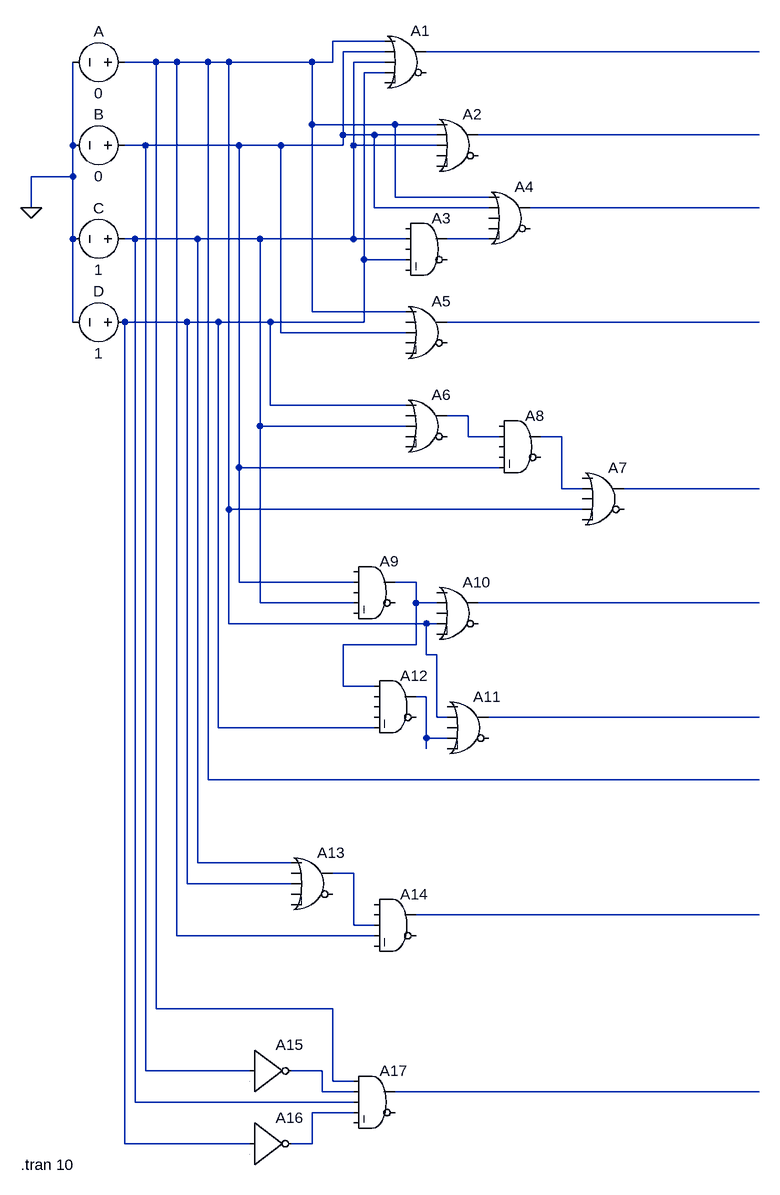
[diagram p0: schematic EqualANDGreater.asc]
EqualANDGreater.asc, the LTspice schematic file:
Version 4.1
SHEET 1 1012 1568
WIRE 432 -176 352 -176
WIRE 432 -160 368 -160
WIRE 1008 -160 496 -160
WIRE 80 -144 32 -144
WIRE 112 -144 80 -144
WIRE 160 -144 112 -144
WIRE 192 -144 160 -144
WIRE 320 -144 192 -144
WIRE 352 -144 352 -176
WIRE 352 -144 320 -144
WIRE 432 -144 384 -144
WIRE 432 -128 400 -128
WIRE 320 -48 320 -144
WIRE 448 -48 320 -48
WIRE 512 -48 448 -48
WIRE 368 -32 368 -160
WIRE 416 -32 368 -32
WIRE 512 -32 416 -32
WIRE 1008 -32 576 -32
WIRE -48 -16 -48 -144
WIRE 64 -16 32 -16
WIRE 208 -16 64 -16
WIRE 272 -16 208 -16
WIRE 368 -16 368 -32
WIRE 368 -16 272 -16
WIRE 384 -16 384 -144
WIRE 512 -16 384 -16
WIRE -48 32 -48 -16
WIRE -48 32 -112 32
WIRE 448 64 448 -48
WIRE 592 64 448 64
WIRE -112 80 -112 32
WIRE 416 80 416 -32
WIRE 592 80 416 80
WIRE 1008 80 656 80
WIRE -48 128 -48 32
WIRE 48 128 32 128
WIRE 144 128 48 128
WIRE 240 128 144 128
WIRE 384 128 384 -16
WIRE 384 128 240 128
WIRE 464 128 384 128
WIRE 592 128 528 128
WIRE 400 160 400 -128
WIRE 464 160 400 160
WIRE 320 240 320 -48
WIRE 464 240 320 240
WIRE -48 256 -48 128
WIRE 128 256 32 256
WIRE 176 256 128 256
WIRE 256 256 176 256
WIRE 400 256 400 160
WIRE 400 256 256 256
WIRE 1008 256 528 256
WIRE 272 272 272 -16
WIRE 464 272 272 272
WIRE 256 384 256 256
WIRE 464 384 256 384
WIRE 560 400 528 400
WIRE 240 416 240 128
WIRE 464 416 240 416
WIRE 560 432 560 400
WIRE 608 432 560 432
WIRE 704 432 672 432
WIRE 208 480 208 -16
WIRE 608 480 208 480
WIRE 704 512 704 432
WIRE 736 512 704 512
WIRE 1008 512 800 512
WIRE 192 544 192 -144
WIRE 736 544 192 544
WIRE 208 656 208 480
WIRE 384 656 208 656
WIRE 480 656 448 656
WIRE 240 688 240 416
WIRE 384 688 240 688
WIRE 480 688 480 656
WIRE 512 688 480 688
WIRE 1008 688 576 688
WIRE 192 720 192 544
WIRE 496 720 192 720
WIRE 512 720 496 720
WIRE 480 752 480 688
WIRE 480 752 368 752
WIRE 496 768 496 720
WIRE 512 768 496 768
WIRE 368 816 368 752
WIRE 416 816 368 816
WIRE 496 832 480 832
WIRE 512 864 512 768
WIRE 528 864 512 864
WIRE 1008 864 592 864
WIRE 176 880 176 256
WIRE 416 880 176 880
WIRE 496 896 496 832
WIRE 528 896 496 896
WIRE 496 912 496 896
WIRE 160 960 160 -144
WIRE 1008 960 160 960
WIRE 144 1088 144 128
WIRE 288 1088 144 1088
WIRE 384 1104 352 1104
WIRE 128 1120 128 256
WIRE 288 1120 128 1120
WIRE 1008 1168 480 1168
WIRE 384 1184 384 1104
WIRE 416 1184 384 1184
WIRE 112 1200 112 -144
WIRE 416 1200 112 1200
WIRE 80 1312 80 -144
WIRE 352 1312 80 1312
WIRE 64 1408 64 -16
WIRE 224 1408 64 1408
WIRE 336 1408 288 1408
WIRE 352 1424 352 1312
WIRE 384 1424 352 1424
WIRE 336 1440 336 1408
WIRE 384 1440 336 1440
WIRE 1008 1440 448 1440
WIRE 48 1456 48 128
WIRE 384 1456 48 1456
WIRE 384 1472 320 1472
WIRE 32 1520 32 256
WIRE 224 1520 32 1520
WIRE 320 1520 320 1472
WIRE 320 1520 288 1520
FLAG -112 80 0
SYMBOL voltage 48 128 R90
WINDOW 0 -32 56 VBottom 2
WINDOW 3 32 56 VTop 2
WINDOW 123 0 0 Left 0
WINDOW 39 0 0 Left 0
SYMATTR InstName C
SYMATTR Value 1
SYMBOL voltage 48 -16 R90
WINDOW 0 -32 56 VBottom 2
WINDOW 3 32 56 VTop 2
WINDOW 123 0 0 Left 0
WINDOW 39 0 0 Left 0
SYMATTR InstName B
SYMATTR Value 0
SYMBOL voltage 48 -144 R90
WINDOW 0 -32 56 VBottom 2
WINDOW 3 32 56 VTop 2
WINDOW 123 0 0 Left 0
WINDOW 39 0 0 Left 0
SYMATTR InstName A
SYMATTR Value 0
SYMBOL voltage 48 256 R90
WINDOW 0 -32 56 VBottom 2
WINDOW 3 32 56 VTop 2
WINDOW 123 0 0 Left 0
WINDOW 39 0 0 Left 0
SYMATTR InstName D
SYMATTR Value 1
SYMBOL Digital\\or 464 -208 R0
SYMATTR InstName A1
SYMBOL Digital\\or 544 -80 R0
SYMATTR InstName A2
SYMBOL Digital\\and 496 80 R0
SYMATTR InstName A3
SYMBOL Digital\\or 624 32 R0
SYMATTR InstName A4
SYMBOL Digital\\or 496 208 R0
SYMATTR InstName A5
SYMBOL Digital\\or 496 352 R0
SYMATTR InstName A6
SYMBOL Digital\\or 768 464 R0
SYMATTR InstName A7
SYMBOL Digital\\and 640 384 R0
SYMATTR InstName A8
SYMBOL Digital\\and 416 608 R0
SYMATTR InstName A9
SYMBOL Digital\\or 544 640 R0
SYMATTR InstName A10
SYMBOL Digital\\or 560 816 R0
SYMATTR InstName A11
SYMBOL Digital\\and 448 784 R0
SYMATTR InstName A12
SYMBOL Digital\\or 320 1056 R0
SYMATTR InstName A13
SYMBOL Digital\\and 448 1120 R0
SYMATTR InstName A14
SYMBOL Digital\\inv 224 1344 R0
SYMATTR InstName A15
SYMBOL Digital\\inv 224 1456 R0
SYMATTR InstName A16
SYMBOL Digital\\and 416 1392 R0
SYMATTR InstName A17
TEXT -128 1552 Left 2 !.tran 10

The netlist it stands for:
* EqualANDGreater.asc
V§C N004 0 1
V§B N002 0 0
V§A N001 0 0
V§D N005 0 1
A1 N001 N002 N004 N005 0 0 N003 0 OR
A2 N001 N002 N004 0 0 0 N006 0 OR
A3 0 N004 0 N005 0 0 N008 0 AND
A4 N001 N002 0 0 N008 0 N007 0 OR
A5 N001 0 N002 0 0 0 N009 0 OR
A6 N005 0 N004 0 0 0 N010 0 OR
A7 0 N011 0 N001 0 0 N012 0 OR
A8 0 N010 0 0 N002 0 N011 0 AND
A9 0 N002 0 N004 0 0 N013 0 AND
A10 0 N013 0 N001 0 0 N014 0 OR
A11 0 N001 0 N015 0 0 N016 0 OR
A12 N013 0 0 0 N005 0 N015 0 AND
A13 N004 0 N005 0 0 0 N017 0 OR
A14 0 0 N017 N001 0 0 N018 0 AND
A15 N002 0 0 0 0 N019 0 0 BUF
A16 N005 0 0 0 0 N021 0 0 BUF
A17 N001 N019 N004 N021 0 0 N020 0 AND
.tran 10
.backanno
.end